# Altium schematic sheet 780-00057, rev2, Pg2, SCH, NRES, Crate Slot MotherBoard.SchDoc
size B; PageSetup: Record=PageOptions|CenterHorizontal=True|CenterVertical=True|PrintScale=1.09|XCorrection=1.00|YCorrection=1.00|PrintKind=0|BorderSize=5000000|LeftOffset=0|BottomOffset=0|Orientation=2|PaperLength=1000|PaperWidth=1000|Scale=100|PaperSource=7|PrintQuality=-4|MediaType=1|DitherType=10|PaperKind=Ledger|PrintScaleMode=1
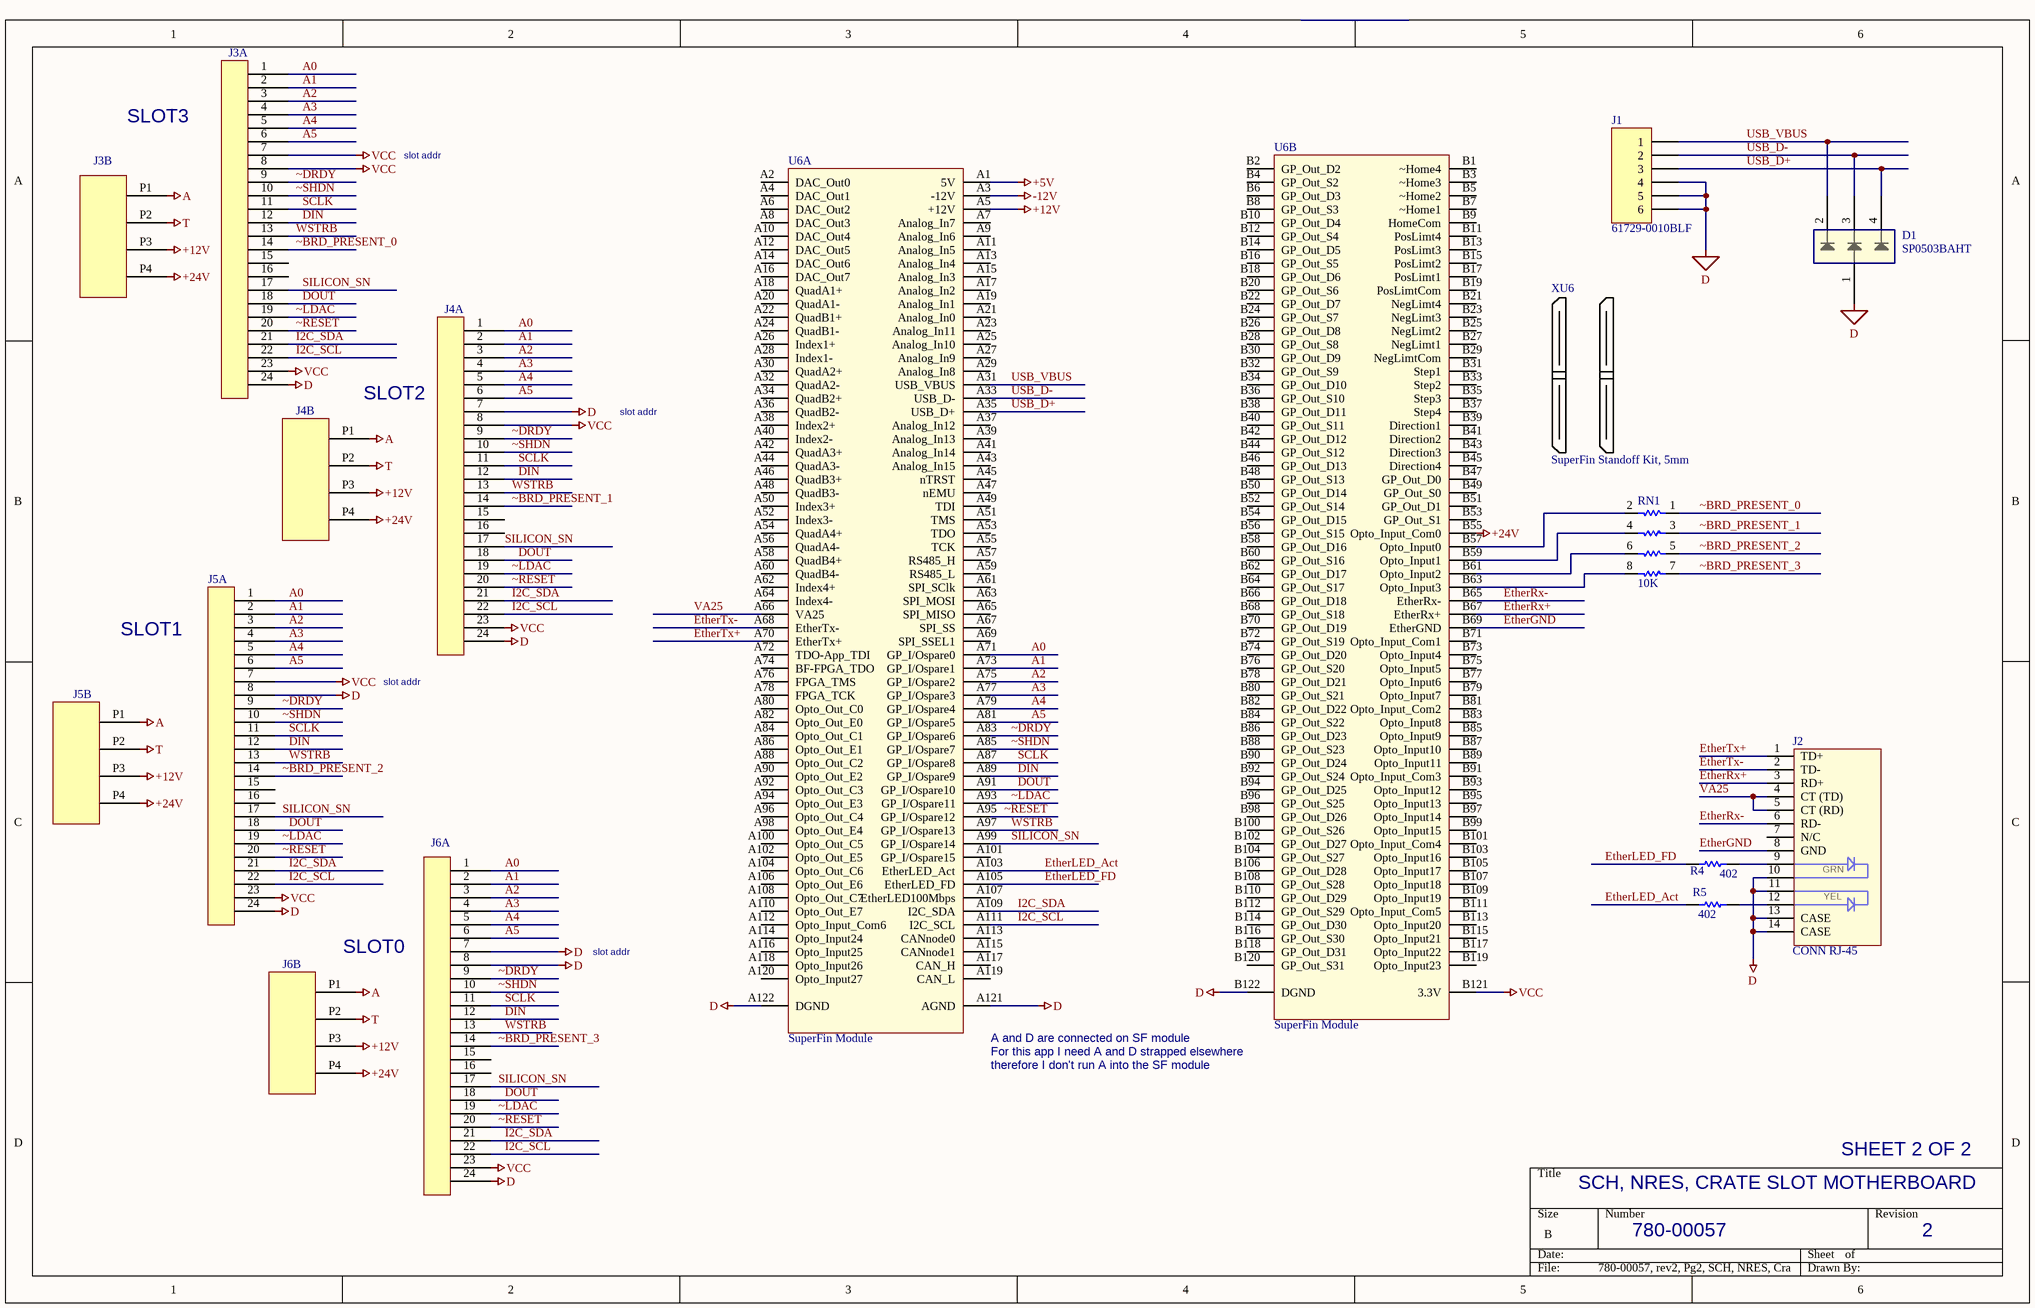
[diagram p0: 780-00057, rev2, Pg2, SCH, NRES, Crate Slot MotherBoard.SchDoc]

## Parts
D1  SP0503BAHT  [SOT-143]
J1  61729-0010BLF  [USB Vertical PCB]
J2  CONN RJ-45  [RJ-45 w/magnetics]
J3  Molex 46114 backplane connector, 24 signal, 4 pwr  [MOLEX 46114 SERIES]  (value not drawn)  (parts A,B of 2)
J4  Molex 46114 backplane connector, 24 signal, 4 pwr  [MOLEX 46114 SERIES]  (value not drawn)  (parts A,B of 2)
J5  Molex 46114 backplane connector, 24 signal, 4 pwr  [MOLEX 46114 SERIES]  (value not drawn)  (parts A,B of 2)
J6  Molex 46114 backplane connector, 24 signal, 4 pwr  [MOLEX 46114 SERIES]  (value not drawn)  (parts A,B of 2)
R4  value 402  [SMD_0805]  (hidden comment: Res 0805)
R5  value 402  [SMD_0805]  (hidden comment: Res 0805)
RN1  value 10K  [RES ARRAY 0603 x 4]  (hidden comment: RES ARRAY  x4 10K)
U6  SuperFin Module  [SuperFin Footprint]  (parts A,B of 2)
XU6  SuperFin Standoff Kit, 5mm  (mechanical)

## Nets
+5V: U6.A1(5V)
+12V: J3.P3(S27) J4.P3(S27) J5.P3(S27) J6.P3(S27) U6.A5(+12V)
+24V: J3.P4(S28) J4.P4(S28) J5.P4(S28) J6.P4(S28) U6.B55(Opto_Input_Com0)
-12V: U6.A3(-12V)
A: J3.P1(S25) J4.P1(S25) J5.P1(S25) J6.P1(S25)
D: D1.1(A) J1.4 J1.5 J1.6 J2.10(GRN-Cathode) J2.11(YEL-Cathode) J2.13(CASE) J2.14(CASE) J3.24 J4.7 J4.24 J5.8 J5.24 J6.7 J6.8 J6.24 U6.A121(AGND) U6.A122(DGND) U6.B122(DGND)
T: J3.P2(S26) J4.P2(S26) J5.P2(S26) J6.P2(S26)
VCC: J3.7 J3.8 J3.23 J4.8 J4.23 J5.7 J5.23 J6.23 U6.B121(3.3V)
A0: J3.1 J4.1 J5.1 J6.1 U6.A71(GP_I/Ospare0)
A1: J3.2 J4.2 J5.2 J6.2 U6.A73(GP_I/Ospare1)
A2: J3.3 J4.3 J5.3 J6.3 U6.A75(GP_I/Ospare2)
A3: J3.4 J4.4 J5.4 J6.4 U6.A77(GP_I/Ospare3)
A4: J3.5 J4.5 J5.5 J6.5 U6.A79(GP_I/Ospare4)
A5: J3.6 J4.6 J5.6 J6.6 U6.A81(GP_I/Ospare5)
DIN: J3.12 J4.12 J5.12 J6.12 U6.A89(GP_I/Ospare9)
DOUT: J3.18 J4.18 J5.18 J6.18 U6.A91(GP_I/Ospare10)
EtherGND: J2.8(GND) U6.B69(EtherGND)
EtherLED_Act: R5.1 U6.A103(EtherLED_Act)
EtherLED_FD: R4.1 U6.A105(EtherLED_FD)
EtherRx+: J2.3(RD+) U6.B67(EtherRx+)
EtherRx-: J2.6(RD-) U6.B65(EtherRx-)
EtherTx+: J2.1(TD+) U6.A70(EtherTx+)
EtherTx-: J2.2(TD-) U6.A68(EtherTx-)
I2C_SCL: J3.22 J4.22 J5.22 J6.22 U6.A111(I2C_SCL)
I2C_SDA: J3.21 J4.21 J5.21 J6.21 U6.A109(I2C_SDA)
SCLK: J3.11 J4.11 J5.11 J6.11 U6.A87(GP_I/Ospare8)
SILICON_SN: J3.17 J4.17 J5.17 J6.17 U6.A99(GP_I/Ospare14)
USB_D+: D1.4(K3) J1.3 U6.A35(USB_D+)
USB_D-: D1.3(K2) J1.2 U6.A33(USB_D-)
USB_VBUS: D1.2(K1) J1.1 U6.A31(USB_VBUS)
VA25: J2.4(CT_(TD)) J2.5(CT_(RD)) U6.A66(VA25)
WSTRB: J3.13 J4.13 J5.13 J6.13 U6.A97(GP_I/Ospare13)
~BRD_PRESENT_0: J3.14 RN1.1
~BRD_PRESENT_1: J4.14 RN1.3
~BRD_PRESENT_2: J5.14 RN1.5
~BRD_PRESENT_3: J6.14 RN1.7
~DRDY: J3.9 J4.9 J5.9 J6.9 U6.A83(GP_I/Ospare6)
~LDAC: J3.19 J4.19 J5.19 J6.19 U6.A93(GP_I/Ospare11)
~RESET: J3.20 J4.20 J5.20 J6.20 U6.A95(GP_I/Ospare12)
~SHDN: J3.10 J4.10 J5.10 J6.10 U6.A85(GP_I/Ospare7)
NetJ2_9: J2.9(GRN-Anode) R4.2
NetJ2_12: J2.12(YEL-Anode) R5.2
NetRN1_2: RN1.2 U6.B57(Opto_Input0)
NetRN1_4: RN1.4 U6.B59(Opto_Input1)
NetRN1_6: RN1.6 U6.B61(Opto_Input2)
NetRN1_8: RN1.8 U6.B63(Opto_Input3)

Not connected (* = marked no-connect by the designer): J2 7(N/C); J3 15 16; J4 15 16; J5 15 16; J6 15 16; U6 A2(DAC_Out0) A4(DAC_Out1) A6(DAC_Out2) A7(Analog_In7) A8(DAC_Out3) A9(Analog_In6) A10(DAC_Out4) A11(Analog_In5) A12(DAC_Out5) A13(Analog_In4) A14(DAC_Out6) A15(Analog_In3) A16(DAC_Out7) A17(Analog_In2) A18(QuadA1+) A19(Analog_In1) A20(QuadA1-) A21(Analog_In0) A22(QuadB1+) A23(Analog_In11) A24(QuadB1-) A25(Analog_In10) A26(Index1+) A27(Analog_In9) A28(Index1-) A29(Analog_In8) A30(QuadA2+) A32(QuadA2-) A34(QuadB2+) A36(QuadB2-) A37(Analog_In12) A38(Index2+) A39(Analog_In13) A40(Index2-) A41(Analog_In14) A42(QuadA3+) A43(Analog_In15) A44(QuadA3-) A45(nTRST) A46(QuadB3+) A47(nEMU) A48(QuadB3-) A49(TDI) A50(Index3+) A51(TMS) A52(Index3-) A53(TDO) A54(QuadA4+) A55(TCK) A56(QuadA4-) A57(RS485_H) A58(QuadB4+) A59(RS485_L) A60(QuadB4-) A61(SPI_SClk) A62(Index4+) A63(SPI_MOSI) A64(Index4-) A65(SPI_MISO) A67(SPI_SS) A69(SPI_SSEL1) A72(TDO-App_TDI) A74(BF-FPGA_TDO) A76(FPGA_TMS) A78(FPGA_TCK) A80(Opto_Out_C0) A82(Opto_Out_E0) A84(Opto_Out_C1) A86(Opto_Out_E1) A88(Opto_Out_C2) A90(Opto_Out_E2) A92(Opto_Out_C3) A94(Opto_Out_E3) A96(Opto_Out_C4) A98(Opto_Out_E4) A100(Opto_Out_C5) A101(GP_I/Ospare15) A102(Opto_Out_E5) A104(Opto_Out_C6) A106(Opto_Out_E6) A107(EtherLED100Mbps) A108(Opto_Out_C7) A110(Opto_Out_E7) A112(Opto_Input_Com6) A113(CANnode0) A114(Opto_Input24) A115(CANnode1) A116(Opto_Input25) A117(CAN_H) A118(Opto_Input26) A119(CAN_L) A120(Opto_Input27) B1(~Home4) B2(GP_Out_D2) B3(~Home3) B4(GP_Out_S2) B5(~Home2) B6(GP_Out_D3) B7(~Home1) B8(GP_Out_S3) B9(HomeCom) B10(GP_Out_D4) B11(PosLimt4) B12(GP_Out_S4) B13(PosLimt3) B14(GP_Out_D5) B15(PosLimt2) B16(GP_Out_S5) B17(PosLimt1) B18(GP_Out_D6) B19(PosLimtCom) B20(GP_Out_S6) B21(NegLimt4) B22(GP_Out_D7) B23(NegLimt3) B24(GP_Out_S7) B25(NegLimt2) B26(GP_Out_D8) B27(NegLimt1) B28(GP_Out_S8) B29(NegLimtCom) B30(GP_Out_D9) B31(Step1) B32(GP_Out_S9) B33(Step2) B34(GP_Out_D10) B35(Step3) B36(GP_Out_S10) B37(Step4) B38(GP_Out_D11) B39(Direction1) B40(GP_Out_S11) B41(Direction2) B42(GP_Out_D12) B43(Direction3) B44(GP_Out_S12) B45(Direction4) B46(GP_Out_D13) B47(GP_Out_D0) B48(GP_Out_S13) B49(GP_Out_S0) B50(GP_Out_D14) B51(GP_Out_D1) B52(GP_Out_S14) B53(GP_Out_S1) B54(GP_Out_D15) B56(GP_Out_S15) B58(GP_Out_D16) B60(GP_Out_S16) B62(GP_Out_D17) B64(GP_Out_S17) B66(GP_Out_D18) B68(GP_Out_S18) B70(GP_Out_D19) B71(Opto_Input_Com1) B72(GP_Out_S19) B73(Opto_Input4) B74(GP_Out_D20) B75(Opto_Input5) B76(GP_Out_S20) B77(Opto_Input6) B78(GP_Out_D21) B79(Opto_Input7) B80(GP_Out_S21) B81(Opto_Input_Com2) B82(GP_Out_D22) B83(Opto_Input8) B84(GP_Out_S22) B85(Opto_Input9) B86(GP_Out_D23) B87(Opto_Input10) B88(GP_Out_S23) B89(Opto_Input11) B90(GP_Out_D24) B91(Opto_Input_Com3) B92(GP_Out_S24) B93(Opto_Input12) B94(GP_Out_D25) B95(Opto_Input13) B96(GP_Out_S25) B97(Opto_Input14) B98(GP_Out_D26) B99(Opto_Input15) B100(GP_Out_S26) B101(Opto_Input_Com4) B102(GP_Out_D27) B103(Opto_Input16) B104(GP_Out_S27) B105(Opto_Input17) B106(GP_Out_D28) B107(Opto_Input18) B108(GP_Out_S28) B109(Opto_Input19) B110(GP_Out_D29) B111(Opto_Input_Com5) B112(GP_Out_S29) B113(Opto_Input20) B114(GP_Out_D30) B115(Opto_Input21) B116(GP_Out_S30) B117(Opto_Input22) B118(GP_Out_D31) B119(Opto_Input23) B120(GP_Out_S31)

## Notes on the sheet
- SLOT3
- slot addr
- (near J4) SLOT2
- SLOT1
- (near J4) slot addr
- (near J6) SLOT0
- (near U6) A and D are connected on SF module
- (near U6) For this app I need A and D strapped elsewhere
- therefore I don't run A into the SF module
- SCH, NRES, CRATE SLOT MOTHERBOARD
- SHEET 2 OF 2
- 780-00057
- 2
- (in symbol CONN RJ-45 with Magnetics) GRN; YEL

## Library data of the parts
D1 = 3-Zener: Manufacturer: LITTLEFUSE; Manuf p/n: SP0503BAHTG; Value: 5.5V 200mW; Vendor: DigiKey; Vendor Mult.: 1; Vendor p/n: F2715CT-ND; LCO p/n: 140-00001; COST: 0.80
J1 = Header 6: Header, 6-Pin; Manufacturer: FCI; Value: USB TYPE B; Vendor: DigiKey; Vendor Mult.: 1; LCO p/n: 125-00039; COST: 1.12
J2 = CONN RJ-45 with Magnetics: Right Angle, Standard Profile, RJ45-Keyed, Flange Mount PCB Jack; LCO p/n: 125-00052
J3-J6 = Molex 46114 backplane connector, 24 signal, 4 pwr: LCO P/N: 125-00370
R4 R5 = Res SMD: Resistor 0805; Manufacturer: Vishay/Dale; Manuf p/n: CRCW0805402FKEA; Vendor: DIGIKEY; Vendor p/n: 541-402CCT-ND; Vendor Mult.: 10; LCO p/n: 181-04020; COST: 0.09
RN1 = RES ARRAY  x4 10K: Resistor Array 4 Isolated; Manufacturer: PANASONIC - ECG; Manuf p/n: EXB-38V103JV; Vendor: DIGIKEY; Vendor p/n: Y9103CT-ND; Vendor Mult.: 10; LCO p/n: 180-00043; COST: 0.03
U6 = SuperFin Module: LCO p/n: 830-00010
XU6 = SuperFin Standoff Kit, 5mm: LCO p/n: 810-00003